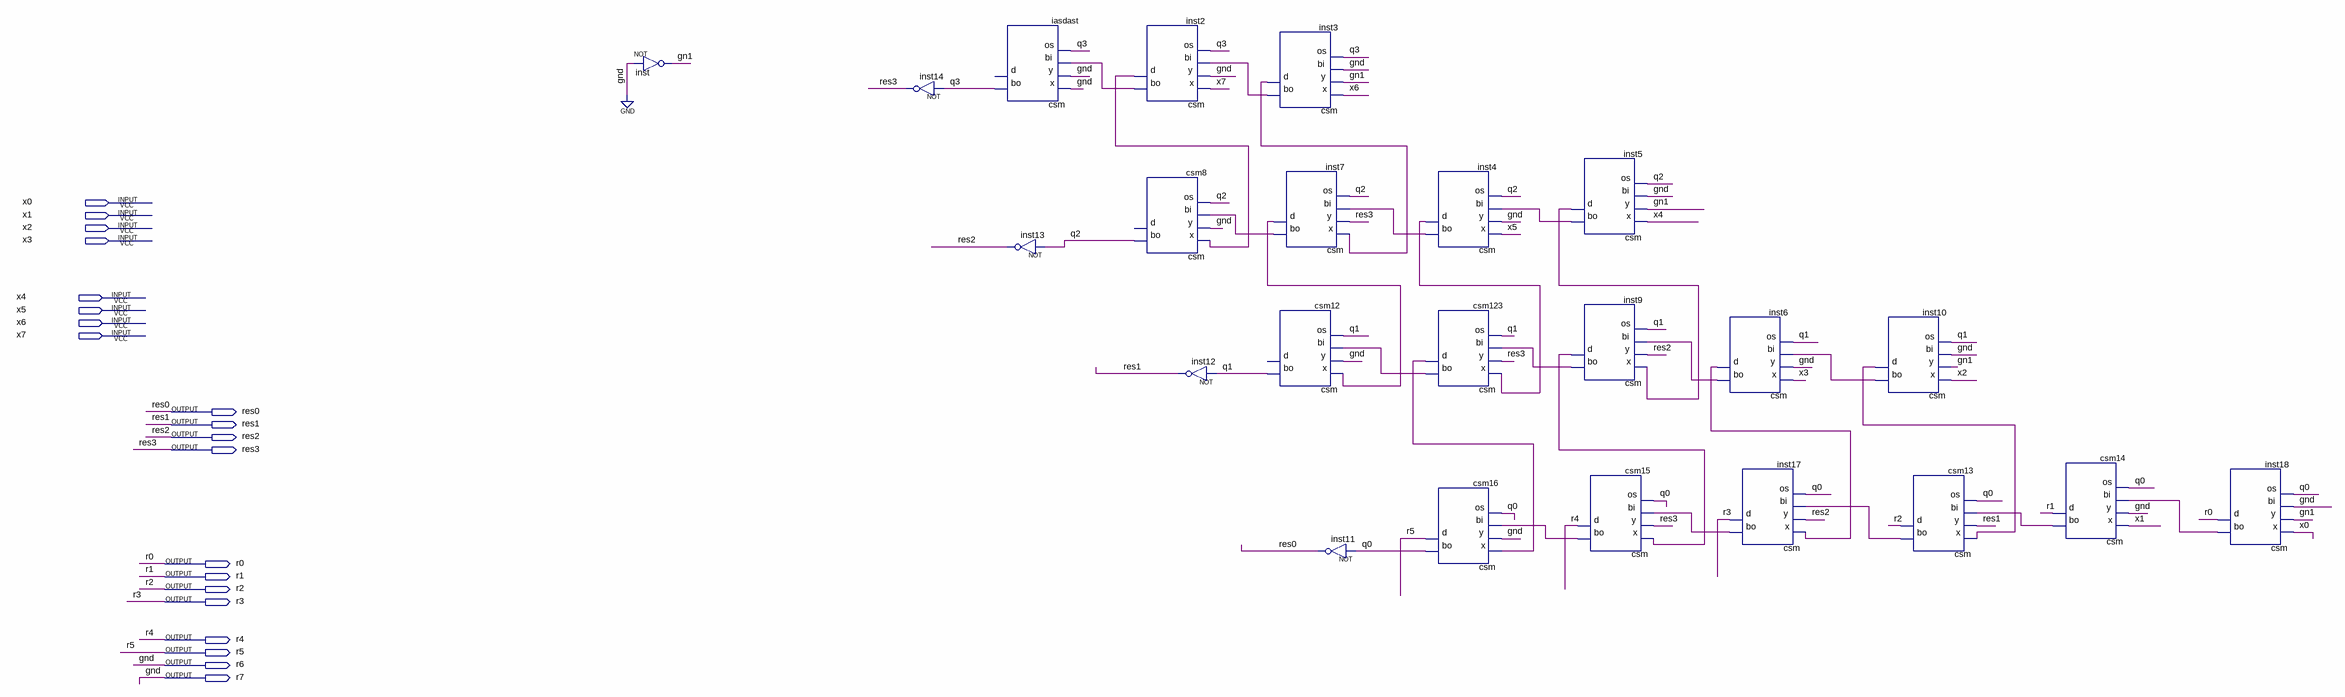
[diagram p0: schematic sheet]
// Quartus schematic raiz.bdf as structural Verilog: 23 symbols, 20 pins
module raiz (
  input  x0,
  input  x1,
  input  x2,
  input  x3,
  input  x4,
  input  x5,
  input  x6,
  input  x7,
  output res0,
  output res1,
  output res2,
  output res3,
  output r0,
  output r1,
  output r2,
  output r3,
  output r4,
  output r5,
  output r6,
  output r7
);

  wire csm13_bo, csm14_bo, csm15_bo, csm123_bo, csm123_d, gn1, inst2_bo, inst2_d, inst3_bo, inst3_d,
       inst4_bo, inst4_d, inst5_bo, inst5_d, inst6_bo, inst6_d, inst7_bo, inst7_d, inst9_bo, inst9_d,
       inst10_bo, inst10_d, inst17_bo, inst18_bo, q0, q1, q2, q3;

  not inst (gn1, 1'b0);
  not inst14 (res3, q3);
  csm iasdast (.x(1'b0), .y(1'b0), .bi(inst2_bo), .os(q3), .bo(q3));  // open: d
  not inst13 (res2, q2);
  csm inst2 (.x(x7), .y(1'b0), .bi(inst3_bo), .os(q3), .bo(inst2_bo), .d(inst2_d));
  csm csm8 (.x(inst2_d), .y(1'b0), .bi(inst7_bo), .os(q2), .bo(q2));  // open: d
  not inst12 (res1, q1);
  csm inst3 (.x(x6), .y(gn1), .bi(1'b0), .os(q3), .bo(inst3_bo), .d(inst3_d));
  csm inst7 (.x(inst3_d), .y(res3), .bi(inst4_bo), .os(q2), .bo(inst7_bo), .d(inst7_d));
  csm csm12 (.x(inst7_d), .y(1'b0), .bi(csm123_bo), .os(q1), .bo(q1));  // open: d
  not inst11 (res0, q0);
  csm inst4 (.x(x5), .y(1'b0), .bi(inst5_bo), .os(q2), .bo(inst4_bo), .d(inst4_d));
  csm csm123 (.x(inst4_d), .y(res3), .bi(inst9_bo), .os(q1), .bo(csm123_bo), .d(csm123_d));
  csm csm16 (.x(csm123_d), .y(1'b0), .bi(csm15_bo), .os(q0), .bo(q0), .d(r5));
  csm inst5 (.x(x4), .y(gn1), .bi(1'b0), .os(q2), .bo(inst5_bo), .d(inst5_d));
  csm inst9 (.x(inst5_d), .y(res2), .bi(inst6_bo), .os(q1), .bo(inst9_bo), .d(inst9_d));
  csm csm15 (.x(inst9_d), .y(res3), .bi(inst17_bo), .os(q0), .bo(csm15_bo), .d(r4));
  csm inst6 (.x(x3), .y(1'b0), .bi(inst10_bo), .os(q1), .bo(inst6_bo), .d(inst6_d));
  csm inst17 (.x(inst6_d), .y(res2), .bi(csm13_bo), .os(q0), .bo(inst17_bo), .d(r3));
  csm inst10 (.x(x2), .y(gn1), .bi(1'b0), .os(q1), .bo(inst10_bo), .d(inst10_d));
  csm csm13 (.x(inst10_d), .y(res1), .bi(csm14_bo), .os(q0), .bo(csm13_bo), .d(r2));
  csm csm14 (.x(x1), .y(1'b0), .bi(inst18_bo), .os(q0), .bo(csm14_bo), .d(r1));
  csm inst18 (.x(x0), .y(gn1), .bi(1'b0), .os(q0), .bo(inst18_bo), .d(r0));

  assign r6 = 1'b0;
  assign r7 = 1'b0;
endmodule
